# Altium schematic sheet 12V0_REG.SchDoc
size B; SheetNumber: 13; SheetTotal: 21
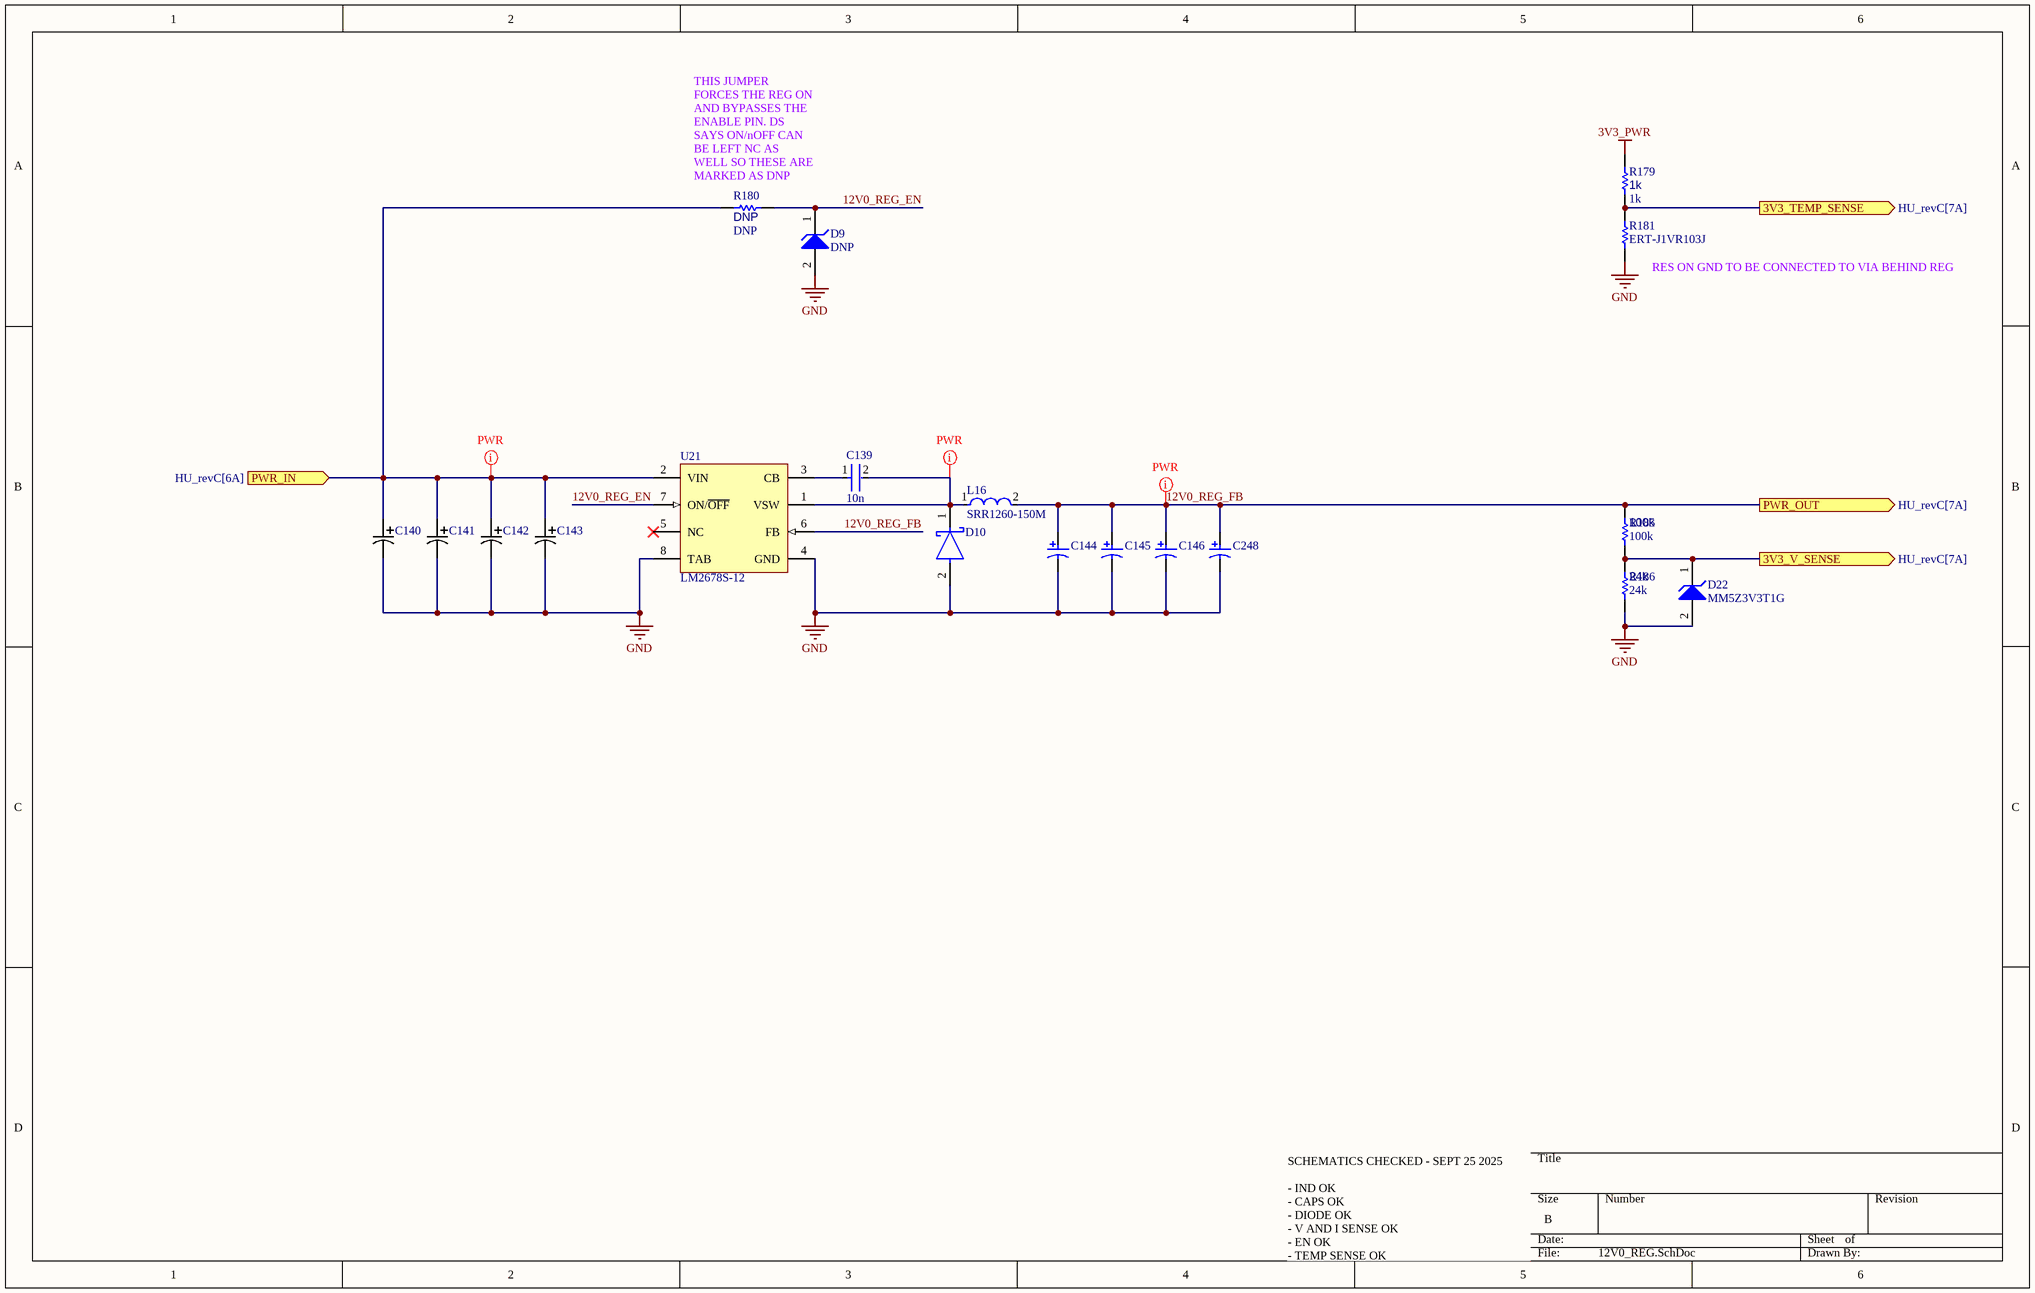
[diagram p0: 12V0_REG.SchDoc]

## Parts
C139  10n  [FP-0402-L_1_0_0_05-W_0_5-IPC_A]
C140  T495D106M035ATE260  [T495D106M035ATE260-Footprint-1]  (value not drawn)
C141  T495D106M035ATE260  [T495D106M035ATE260-Footprint-1]  (value not drawn)
C142  T495D106M035ATE260  [T495D106M035ATE260-Footprint-1]  (value not drawn)
C143  T495D106M035ATE260  [T495D106M035ATE260-Footprint-1]  (value not drawn)
C144  T495D686K020ATE150  [KEMT-T495-D_L]  (value not drawn)
C145  T495D686K020ATE150  [KEMT-T495-D_L]  (value not drawn)
C146  T495D686K020ATE150  [KEMT-T495-D_L]  (value not drawn)
C248  T495D686K020ATE150  [KEMT-T495-D_L]  (value not drawn)
D9  DNP  [ONSC-SOD-523-2-502-01_V]
D10  B540C-13-F  [FP-SMC-MFG]  (value not drawn)
D22  MM5Z3V3T1G  [ONSC-SOD-523-2-502-01_V]
L16  SRR1260-150M  [FP-SRR1260-MFG]
R179  1k  [R0603B]
R180  DNP  [R0603B]
R181  ERT-J1VR103J  [RESC1608X90X30ML15T20]
R185  100k  [R0603B]
R186  24k  [R0603B]
U21  LM2678S-12  [KTW0007B_L]

## Ports
3V3_TEMP_SENSE (out, see HU_revC[7A]), 3V3_V_SENSE (out, see HU_revC[7A]), PWR_IN (in, see HU_revC[6A]), PWR_OUT (out, see HU_revC[7A])

## Nets
3V3_PWR: R179.1
GND: C140.2 C141.2 C142.2 C143.2 C144.2 C145.2 C146.2 C248.2 D9.2(A) D10.2(A) D22.2(A) R181.1 R186.1 U21.4(GND) U21.8(TAB)
3V3_TEMP_SENSE: R179.2 R181.2 ; port 3V3_TEMP_SENSE
3V3_V_SENSE: D22.1(K) R185.1 R186.2 ; port 3V3_V_SENSE
12V0_REG_EN: D9.1(K) R180.2 U21.7(ON/~{OFF})
12V0_REG_FB: C144.1 C145.1 C146.1 C248.1 L16.2 R185.2 U21.6(FB) ; port PWR_OUT
PWR_IN: C140.1 C141.1 C142.1 C143.1 R180.1 U21.2(VIN) ; port PWR_IN
NetC139_1: C139.1 U21.3(CB)
NetC139_2: C139.2 D10.1(C) L16.1 U21.1(VSW)

Not connected (* = marked no-connect by the designer): U21 5(NC)*

## Layout directives
net class PWR: 12V0_REG_FB, NetC139_2, PWR_IN

## Notes on the sheet
- (near R180) THIS JUMPER FORCES THE REG ON AND BYPASSES THE ENABLE PIN. DS SAYS ON/nOFF CAN BE LEFT NC AS WELL SO THESE ARE MARKED AS DNP
- (near R181) RES ON GND TO BE CONNECTED TO VIA BEHIND REG
- SCHEMATICS CHECKED - SEPT 25 2025
  - IND OK
  - CAPS OK
  - DIODE OK
  - V AND I SENSE OK
  - EN OK
  - TEMP SENSE OK

## Library data of the parts
C139 = CMP-001-00058-1: LARGE PADS, 0402 CAP, CHANGE COMMENT TO MATCH REAL P/N; Capacitor Type: Ceramic; Min Operating Temperature: -55°C; Mounting Technology: Surface Mount; Pins: 2; Case/Package: 0402; RoHS Compliant: Yes; Max Operating Temperature: 85°C
C140-C143 = CMP-001-00065-3: Tantalum Capacitor, Polarized, Tantalum (dry/solid), 35V, 20% +Tol, 20% -Tol, 10uF, Surface Mount, 2917; Value: 10µF; Case/Package: Molded; Mounting Technology: Surface Mount; Max Operating Temperature: 125°C; Tolerance: 20%; Min Operating Temperature: -55°C
C144-C146 C248 = CMP-2000-07208-1: T495D686K020ATE150 - diff p/n (68U 20V); Manufacturer: Kemet; Capacitance: 150µF; ESR: 0.1ohm; Voltage Rating: 10V; Capacitance Tolerance: ±10%; Capacitor Terminals: SMD; Capacitor Case Style: 2917; Package Description: 2-Pin Surface Mount Device, Body 7.3 x 4.3 mm; MSL: MSL1-Unlimited; Package Reference: T495-D; Mounting Technology: SurfaceMount; Datasheet URL: http://capacitoredge.kemet.com/capedge2/DataSheet/Datasheet-T495D157K010ATE100.pdf?pn=T495D157K010ATE100; Datasheet Version: 09/2016; Operating Temperature Range: -55°Cto+125°C; Manufacturer URL: http://www.kemet.com/
D9 = CMP-1060-00750-1: Zener Voltage Regulator, 500 mW, 2-Pin SOD-523, Pb-Free, Tape and Reel; Manufacturer: On Semiconductor; PartNumber: MM5Z3V3T1G; P Max (W): 0.5; VZ Typ (V): 3.3; RoHS: Pb-Free; ComponentLink2Description: Datasheet; PackageReference: SOD-523-2-502-01; DatasheetVersion: Rev. 10; ComponentLink1Description: Manufacturer URL; PackageVersion: Rev. E, 09/2010; ComponentLink3URL: http://www.onsemi.com/pub_link/Collateral/502-01.PDF; ComponentLink2URL: http://www.onsemi.cn/pub_link/Collateral/MM5Z2V4T1-D.PDF; Mounting Technology: Surface Mount; Packing: Tape and Reel; PackageDescription: 2-Pin SOD, Body 1.2 x 0.8 mm; ComponentLink1URL: http://www.onsemi.com/; ComponentLink3Description: Package Specification
D10 = CMP-2000-05097-3: DIODE SCHOTTKY 40V 5A SMC; Manufacturer: Diodes Inc.; Automotive Grade: NA; Peak Reverse Current: 0.5mA; Value: 300pF; Max Junction Temp: +150°C; Max Surge Forward Current: 100A; Standoff Height: 0.1mm; Digikey Description: DIODE SCHOTTKY 40V 5A SMC; Temperature Range Low: -55°C; Manufacturer Part Number: B540C-13-F; Octopart: https://octopart.com/b540c-13-f-diodes+inc.-325873; Lead Free: Yes; Reverse Voltage: 40V; RoHS: TRUE; Category: Diode; Mouser Description: Diode: Schottky rectifying; SMD; 40V; 5A; SMC; Package: reel, tape; ComponentLink2Description: Datasheet; Temperature Range High: +150°C; Automotive: No; Footprint Url: https://www.diodes.com/assets/Package-Files/SMC.pdf; Device Class L3: Schottky Diodes; Height: 2.5mm; Forward Current: 5A; Temperature: -55°C to +150°C; Package: SMC; ComponentLink2URL: https://www.diodes.com/assets/Datasheets/ds13012.pdf; Device Class L2: Diodes; Max Repetitive Reverse Voltage: 40V; Device Class L1: Discrete Semiconductors; Capacitance: 300pF
D22 = CMP-1060-00750-1: Zener Voltage Regulator, 500 mW, 2-Pin SOD-523, Pb-Free, Tape and Reel; Manufacturer: On Semiconductor; P Max (W): 0.5; VZ Typ (V): 3.3; RoHS: Pb-Free; ComponentLink2Description: Datasheet; PackageReference: SOD-523-2-502-01; DatasheetVersion: Rev. 10; ComponentLink1Description: Manufacturer URL; PackageVersion: Rev. E, 09/2010; ComponentLink3URL: http://www.onsemi.com/pub_link/Collateral/502-01.PDF; ComponentLink2URL: http://www.onsemi.cn/pub_link/Collateral/MM5Z2V4T1-D.PDF; Mounting Technology: Surface Mount; PartNumber: MM5Z3V3T1G; Packing: Tape and Reel; PackageDescription: 2-Pin SOD, Body 1.2 x 0.8 mm; ComponentLink1URL: http://www.onsemi.com/; ComponentLink3Description: Package Specification
L16 = CMP-2000-07146-2: FIXED IND 15UH 5A 27 MOHM SMD; Q Factor: 25; Sample Rate (Hz): 100kHz; Resistance: 27MR; Material: Steel; Inductance Tolerance: 20%; Frequency: 17.6MHz; Saturation Current: 4.6A; Core Material: Ferrite; Shielding: Shielded; Series: SRR1260; Termination: SMD/SMT; Packaging: Tape and Reel; RoHS Compliant: Yes; Height - Seated (Max): 0.256inch; Depth: 12.8mm; Case/Package: 1260; Inductance: 15uH; Height: 6mm; Number of Pins: 2; Mount: Surface Mount; Min Operating Temperature: -40°C; Test Frequency: 100kHz; Length: 12.5mm; Self Resonant Frequency: 17.6MHz; Current Rating: 5A; Tolerance: 20%; RMS Current (Irms): 5A; REACH SVHC: No SVHC; Resistor Type: Wirewound; DC Resistance (DCR): 27mR; Width: 12.5mm; Package Quantity: 600; DC Current: 5A; Max DC Current: 5A; Max Operating Temperature: 125°C; Military Standard: Not
R179 R180 R185 R186 = CMP-009-00002-14: Resistor
  R179: Value: 1k
  R180: Value: DNP
  R185: Value: 100k
  R186: Value: 24k
R181 = CMP-2000-00869-1: Manufacturer: Panasonic; Part Number: ERT-J1VR103J
U21 = CMP-0069-00194-3: SIMPLE SWITCHER® High Efficiency 5A Step-Down Voltage Regulator, 7-pin TO-263; Manufacturer: Texas Instruments; PackageTopMarking: NSUZXYTTE#*LM2678*S-12; PowerWise: N; PackageDescription: TO-263, Molded, .400 x .390 x .180in Body, 7 Lead, .050in Pitch, Surface Mount; ComponentLink1URL: http://www.ti.com/general/docs/lit/getliterature.tsp?genericPartNumber=LM2678&fileType=pdf; PackageReference: KTW0007B; RoHS: N; Code_JEDEC: MO-169-AC; PinCount: 7; CompType: Switcher; ComponentLink1Description: Datasheet URL